# EAGLE design ProtoPass (EAGLE 8.2.1)
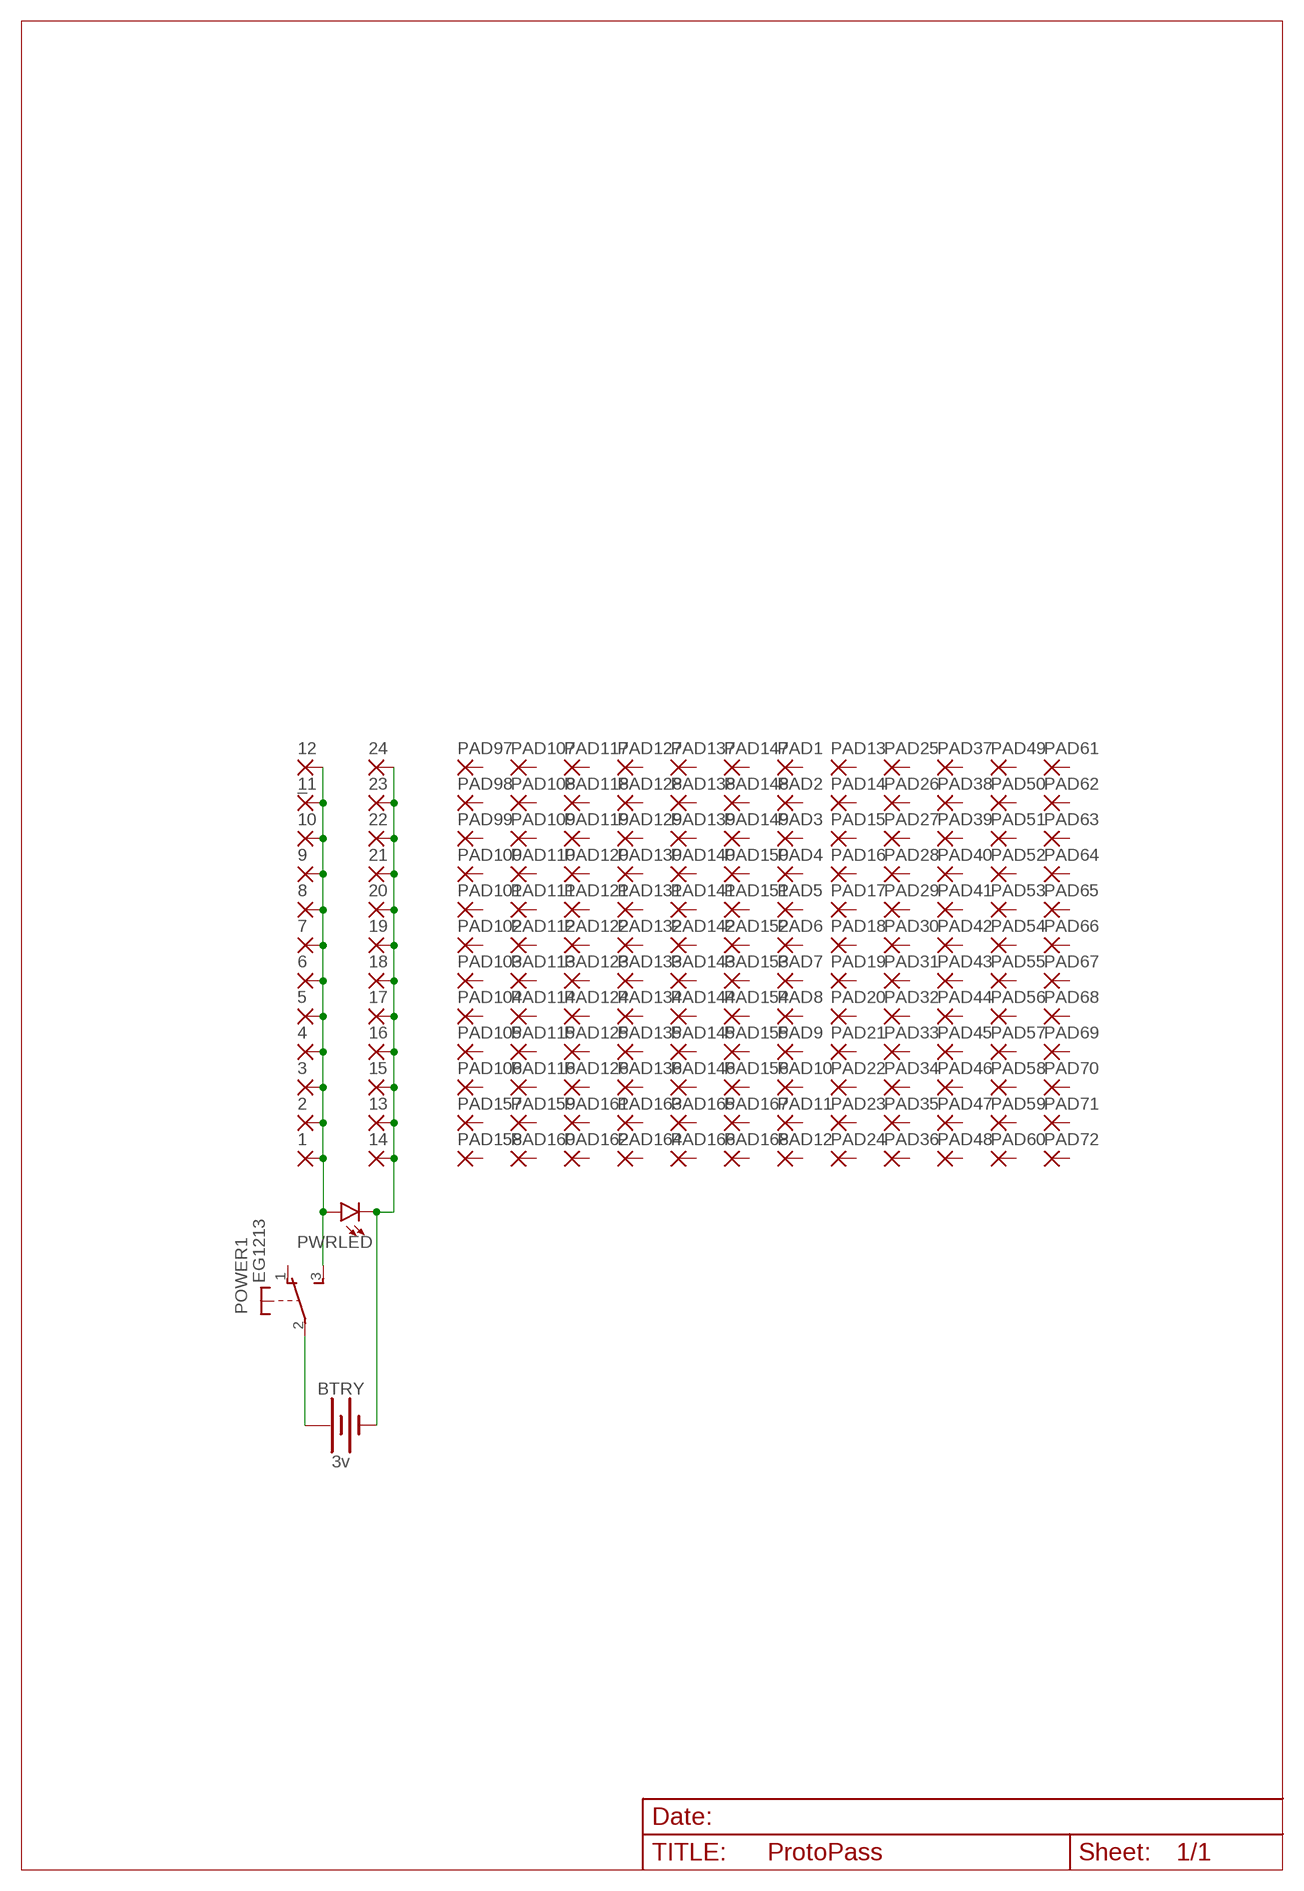
[diagram p0: schematic, sheet 1]

## Parts
1  1,6/0,9  [1,6/0,9]
2  1,6/0,9  [1,6/0,9]
3  1,6/0,9  [1,6/0,9]
4  1,6/0,9  [1,6/0,9]
5  1,6/0,9  [1,6/0,9]
6  1,6/0,9  [1,6/0,9]
7  1,6/0,9  [1,6/0,9]
8  1,6/0,9  [1,6/0,9]
9  1,6/0,9  [1,6/0,9]
10  1,6/0,9  [1,6/0,9]
11  1,6/0,9  [1,6/0,9]
12  _  1,6/0,9  [1,6/0,9]
13  1,6/0,9  [1,6/0,9]
14  1,6/0,9  [1,6/0,9]
15  1,6/0,9  [1,6/0,9]
16  1,6/0,9  [1,6/0,9]
17  1,6/0,9  [1,6/0,9]
18  1,6/0,9  [1,6/0,9]
19  1,6/0,9  [1,6/0,9]
20  1,6/0,9  [1,6/0,9]
21  1,6/0,9  [1,6/0,9]
22  1,6/0,9  [1,6/0,9]
23  1,6/0,9  [1,6/0,9]
24  1,6/0,9  [1,6/0,9]
BTRY  3v  BATTERY-20MM_SMD_4LEGS_OVERPASTE  [BATTCON_20MM_4LEGS_OVERPASTE]
PAD1  1,6/0,9  [1,6/0,9]
PAD2  1,6/0,9  [1,6/0,9]
PAD3  1,6/0,9  [1,6/0,9]
PAD4  1,6/0,9  [1,6/0,9]
PAD5  1,6/0,9  [1,6/0,9]
PAD6  1,6/0,9  [1,6/0,9]
PAD7  1,6/0,9  [1,6/0,9]
PAD8  1,6/0,9  [1,6/0,9]
PAD9  1,6/0,9  [1,6/0,9]
PAD10  1,6/0,9  [1,6/0,9]
PAD11  1,6/0,9  [1,6/0,9]
PAD12  1,6/0,9  [1,6/0,9]
PAD13  1,6/0,9  [1,6/0,9]
PAD14  1,6/0,9  [1,6/0,9]
PAD15  1,6/0,9  [1,6/0,9]
PAD16  1,6/0,9  [1,6/0,9]
PAD17  1,6/0,9  [1,6/0,9]
PAD18  1,6/0,9  [1,6/0,9]
PAD19  1,6/0,9  [1,6/0,9]
PAD20  1,6/0,9  [1,6/0,9]
PAD21  1,6/0,9  [1,6/0,9]
PAD22  1,6/0,9  [1,6/0,9]
PAD23  1,6/0,9  [1,6/0,9]
PAD24  1,6/0,9  [1,6/0,9]
PAD25  1,6/0,9  [1,6/0,9]
PAD26  1,6/0,9  [1,6/0,9]
PAD27  1,6/0,9  [1,6/0,9]
PAD28  1,6/0,9  [1,6/0,9]
PAD29  1,6/0,9  [1,6/0,9]
PAD30  1,6/0,9  [1,6/0,9]
PAD31  1,6/0,9  [1,6/0,9]
PAD32  1,6/0,9  [1,6/0,9]
PAD33  1,6/0,9  [1,6/0,9]
PAD34  1,6/0,9  [1,6/0,9]
PAD35  1,6/0,9  [1,6/0,9]
PAD36  1,6/0,9  [1,6/0,9]
PAD37  1,6/0,9  [1,6/0,9]
PAD38  1,6/0,9  [1,6/0,9]
PAD39  1,6/0,9  [1,6/0,9]
PAD40  1,6/0,9  [1,6/0,9]
PAD41  1,6/0,9  [1,6/0,9]
PAD42  1,6/0,9  [1,6/0,9]
PAD43  1,6/0,9  [1,6/0,9]
PAD44  1,6/0,9  [1,6/0,9]
PAD45  1,6/0,9  [1,6/0,9]
PAD46  1,6/0,9  [1,6/0,9]
PAD47  1,6/0,9  [1,6/0,9]
PAD48  1,6/0,9  [1,6/0,9]
PAD49  1,6/0,9  [1,6/0,9]
PAD50  1,6/0,9  [1,6/0,9]
PAD51  1,6/0,9  [1,6/0,9]
PAD52  1,6/0,9  [1,6/0,9]
PAD53  1,6/0,9  [1,6/0,9]
PAD54  1,6/0,9  [1,6/0,9]
PAD55  1,6/0,9  [1,6/0,9]
PAD56  1,6/0,9  [1,6/0,9]
PAD57  1,6/0,9  [1,6/0,9]
PAD58  1,6/0,9  [1,6/0,9]
PAD59  1,6/0,9  [1,6/0,9]
PAD60  1,6/0,9  [1,6/0,9]
PAD61  1,6/0,9  [1,6/0,9]
PAD62  1,6/0,9  [1,6/0,9]
PAD63  1,6/0,9  [1,6/0,9]
PAD64  1,6/0,9  [1,6/0,9]
PAD65  1,6/0,9  [1,6/0,9]
PAD66  1,6/0,9  [1,6/0,9]
PAD67  1,6/0,9  [1,6/0,9]
PAD68  1,6/0,9  [1,6/0,9]
PAD69  1,6/0,9  [1,6/0,9]
PAD70  1,6/0,9  [1,6/0,9]
PAD71  1,6/0,9  [1,6/0,9]
PAD72  1,6/0,9  [1,6/0,9]
PAD97  1,6/0,9  [1,6/0,9]
PAD98  1,6/0,9  [1,6/0,9]
PAD99  1,6/0,9  [1,6/0,9]
PAD100  1,6/0,9  [1,6/0,9]
PAD101  1,6/0,9  [1,6/0,9]
PAD102  1,6/0,9  [1,6/0,9]
PAD103  1,6/0,9  [1,6/0,9]
PAD104  1,6/0,9  [1,6/0,9]
PAD105  1,6/0,9  [1,6/0,9]
PAD106  1,6/0,9  [1,6/0,9]
PAD107  1,6/0,9  [1,6/0,9]
PAD108  1,6/0,9  [1,6/0,9]
PAD109  1,6/0,9  [1,6/0,9]
PAD110  1,6/0,9  [1,6/0,9]
PAD111  1,6/0,9  [1,6/0,9]
PAD112  1,6/0,9  [1,6/0,9]
PAD113  1,6/0,9  [1,6/0,9]
PAD114  1,6/0,9  [1,6/0,9]
PAD115  1,6/0,9  [1,6/0,9]
PAD116  1,6/0,9  [1,6/0,9]
PAD117  1,6/0,9  [1,6/0,9]
PAD118  1,6/0,9  [1,6/0,9]
PAD119  1,6/0,9  [1,6/0,9]
PAD120  1,6/0,9  [1,6/0,9]
PAD121  1,6/0,9  [1,6/0,9]
PAD122  1,6/0,9  [1,6/0,9]
PAD123  1,6/0,9  [1,6/0,9]
PAD124  1,6/0,9  [1,6/0,9]
PAD125  1,6/0,9  [1,6/0,9]
PAD126  1,6/0,9  [1,6/0,9]
PAD127  1,6/0,9  [1,6/0,9]
PAD128  1,6/0,9  [1,6/0,9]
PAD129  1,6/0,9  [1,6/0,9]
PAD130  1,6/0,9  [1,6/0,9]
PAD131  1,6/0,9  [1,6/0,9]
PAD132  1,6/0,9  [1,6/0,9]
PAD133  1,6/0,9  [1,6/0,9]
PAD134  1,6/0,9  [1,6/0,9]
PAD135  1,6/0,9  [1,6/0,9]
PAD136  1,6/0,9  [1,6/0,9]
PAD137  1,6/0,9  [1,6/0,9]
PAD138  1,6/0,9  [1,6/0,9]
PAD139  1,6/0,9  [1,6/0,9]
PAD140  1,6/0,9  [1,6/0,9]
PAD141  1,6/0,9  [1,6/0,9]
PAD142  1,6/0,9  [1,6/0,9]
PAD143  1,6/0,9  [1,6/0,9]
PAD144  1,6/0,9  [1,6/0,9]
PAD145  1,6/0,9  [1,6/0,9]
PAD146  1,6/0,9  [1,6/0,9]
PAD147  1,6/0,9  [1,6/0,9]
PAD148  1,6/0,9  [1,6/0,9]
PAD149  1,6/0,9  [1,6/0,9]
PAD150  1,6/0,9  [1,6/0,9]
PAD151  1,6/0,9  [1,6/0,9]
PAD152  1,6/0,9  [1,6/0,9]
PAD153  1,6/0,9  [1,6/0,9]
PAD154  1,6/0,9  [1,6/0,9]
PAD155  1,6/0,9  [1,6/0,9]
PAD156  1,6/0,9  [1,6/0,9]
PAD157  1,6/0,9  [1,6/0,9]
PAD158  1,6/0,9  [1,6/0,9]
PAD159  1,6/0,9  [1,6/0,9]
PAD160  1,6/0,9  [1,6/0,9]
PAD161  1,6/0,9  [1,6/0,9]
PAD162  1,6/0,9  [1,6/0,9]
PAD163  1,6/0,9  [1,6/0,9]
PAD164  1,6/0,9  [1,6/0,9]
PAD165  1,6/0,9  [1,6/0,9]
PAD166  1,6/0,9  [1,6/0,9]
PAD167  1,6/0,9  [1,6/0,9]
PAD168  1,6/0,9  [1,6/0,9]
POWER  EG1213  [EG1213]
PWRLED  LED5MM  [LED_5MM]

## Nets
N$1: 13.1(P) 14.1(P) 15.1(P) 16.1(P) 17.1(P) 18.1(P) 19.1(P) 20.1(P) 21.1(P) 22.1(P) 23.1(P) 24.1(P) BTRY.2(-) PWRLED.K(C)
N$2: BTRY.1(+) POWER.2(1:P)
N$4: 1.1(P) 2.1(P) 3.1(P) 4.1(P) 5.1(P) 6.1(P) 7.1(P) 8.1(P) 9.1(P) 10.1(P) 11.1(P) 12.1(P) POWER.3(1:S) PWRLED.A
Unconnected: PAD1.1(P) PAD2.1(P) PAD3.1(P) PAD4.1(P) PAD5.1(P) PAD6.1(P) PAD7.1(P) PAD8.1(P) PAD9.1(P) PAD10.1(P) PAD11.1(P) PAD12.1(P) PAD13.1(P) PAD14.1(P) PAD15.1(P) PAD16.1(P) PAD17.1(P) PAD18.1(P) PAD19.1(P) PAD20.1(P) PAD21.1(P) PAD22.1(P) PAD23.1(P) PAD24.1(P) PAD25.1(P) PAD26.1(P) PAD27.1(P) PAD28.1(P) PAD29.1(P) PAD30.1(P) PAD31.1(P) PAD32.1(P) PAD33.1(P) PAD34.1(P) PAD35.1(P) PAD36.1(P) PAD37.1(P) PAD38.1(P) PAD39.1(P) PAD40.1(P) PAD41.1(P) PAD42.1(P) PAD43.1(P) PAD44.1(P) PAD45.1(P) PAD46.1(P) PAD47.1(P) PAD48.1(P) PAD49.1(P) PAD50.1(P) PAD51.1(P) PAD52.1(P) PAD53.1(P) PAD54.1(P) PAD55.1(P) PAD56.1(P) PAD57.1(P) PAD58.1(P) PAD59.1(P) PAD60.1(P) PAD61.1(P) PAD62.1(P) PAD63.1(P) PAD64.1(P) PAD65.1(P) PAD66.1(P) PAD67.1(P) PAD68.1(P) PAD69.1(P) PAD70.1(P) PAD71.1(P) PAD72.1(P) PAD97.1(P) PAD98.1(P) PAD99.1(P) PAD100.1(P) PAD101.1(P) PAD102.1(P) PAD103.1(P) PAD104.1(P) PAD105.1(P) PAD106.1(P) PAD107.1(P) PAD108.1(P) PAD109.1(P) PAD110.1(P) PAD111.1(P) PAD112.1(P) PAD113.1(P) PAD114.1(P) PAD115.1(P) PAD116.1(P) PAD117.1(P) PAD118.1(P) PAD119.1(P) PAD120.1(P) PAD121.1(P) PAD122.1(P) PAD123.1(P) PAD124.1(P) PAD125.1(P) PAD126.1(P) PAD127.1(P) PAD128.1(P) PAD129.1(P) PAD130.1(P) PAD131.1(P) PAD132.1(P) PAD133.1(P) PAD134.1(P) PAD135.1(P) PAD136.1(P) PAD137.1(P) PAD138.1(P) PAD139.1(P) PAD140.1(P) PAD141.1(P) PAD142.1(P) PAD143.1(P) PAD144.1(P) PAD145.1(P) PAD146.1(P) PAD147.1(P) PAD148.1(P) PAD149.1(P) PAD150.1(P) PAD151.1(P) PAD152.1(P) PAD153.1(P) PAD154.1(P) PAD155.1(P) PAD156.1(P) PAD157.1(P) PAD158.1(P) PAD159.1(P) PAD160.1(P) PAD161.1(P) PAD162.1(P) PAD163.1(P) PAD164.1(P) PAD165.1(P) PAD166.1(P) PAD167.1(P) PAD168.1(P) POWER.1(1:O) POWER.MT1(MT) POWER.MT2(MT)

## Library data of the parts
1-24 PAD1-PAD72 PAD97-PAD168 = wirepad:1,6/0,9: THROUGH-HOLE PAD
BTRY = SparkFun-Batteries:BATTERY: Battery - Single Cell A variety of battery chemistries, sizes, and footprints. Device List: 20MM_PTH - Coin Cell Battery Holder - 20mm (PTH) <https://www.sparkfun.com/products/783> 12MM_SMD - Coin Cell Battery Holder - 12mm (SMD) <https://www.sparkfun.com/products/10592> 12MM_PTH - Coin Cell Battery Holder - 12mm (PTH) <https://www.sparkfun.com/products/7948> 20MM_SMD - 20mm Coin Cell Battery Holder (SMD) (2 legs) Used on the Big Time Watch Kit <https://www.sparkfun.com/products/11734> 20MM_SMD_4LEGS - Coin Cell Battery Holder - 20mm (SMD) <https://www.sparkfun.com/products/11892> 20MM_SMD_4LEGS_OVERPASTE - Coin Cell Battery Holder - 20mm (SMD) <https://www.sparkfun.com/products/11892> (Over-paste on the legs) 24.5MM_PTH - Coin Cell Battery Holder - 24.5mm (PTH) <https://www.sparkfun.com/products/8863> 9V - 9V Battery Holder - PC Mount Used on the SparkFun SparkPunk Sound Kit <https://www.sparkfun.com/products/11177> and SparkFun SparkPunk Sequencer Kit <https://www.sparkfun.com/products/12707> 18650 - Battery Holder - 18650 (PTH) <https://www.sparkfun.com/products/13113> AA - Battery Holder - 1xAA (PTH) <https://www.sparkfun.com/products/7949> AAA - Battery Holder - 1xAAA (PTH) <https://www.sparkfun.com/products/12718> AA_KIT - Battery Holder - 1xAA (PTH) <https://www.sparkfun.com/products/7949> Special kit package - pads only have exposed copper on one side of the board. AAA_KIT - Battery Holder - 1xAAA (PTH) <https://www.sparkfun.com/products/12718> Special kit package - pads only have exposed copper on one side of the board.; PROD_ID: PRT-11892; SF_SKU: BATT-10373
POWER = adafruit:EG1213: E-Switch right-angle slide SPDT Part #EG1213 http://www.ladyada.net/library/eagle
PWRLED = SparkFun-LED:LED: LED (Generic) Standard schematic elements and footprints for 5mm, 3mm, 1206, and 0603 sized LEDs. Generic LEDs with no color specified.

## Board
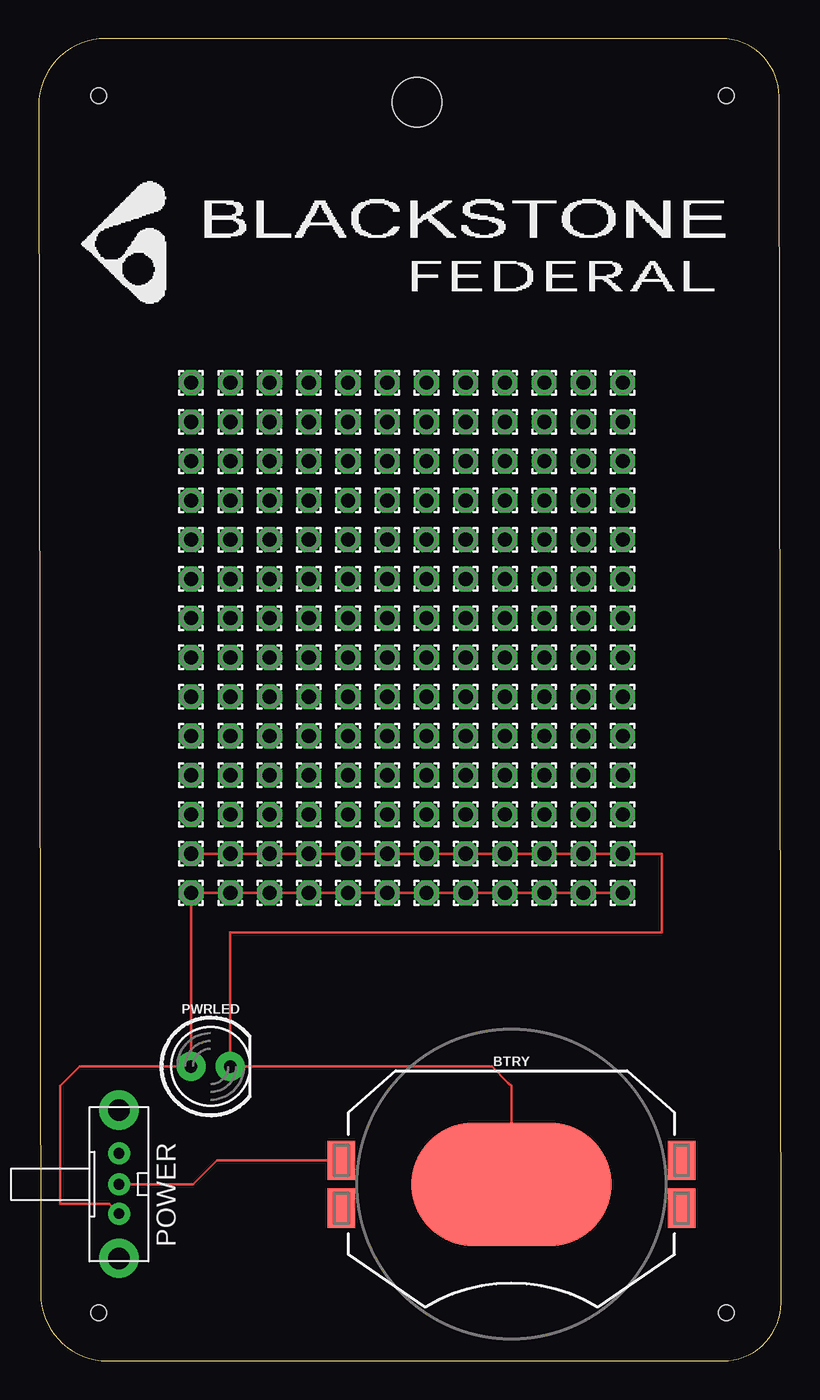
[diagram p1: board, top side]
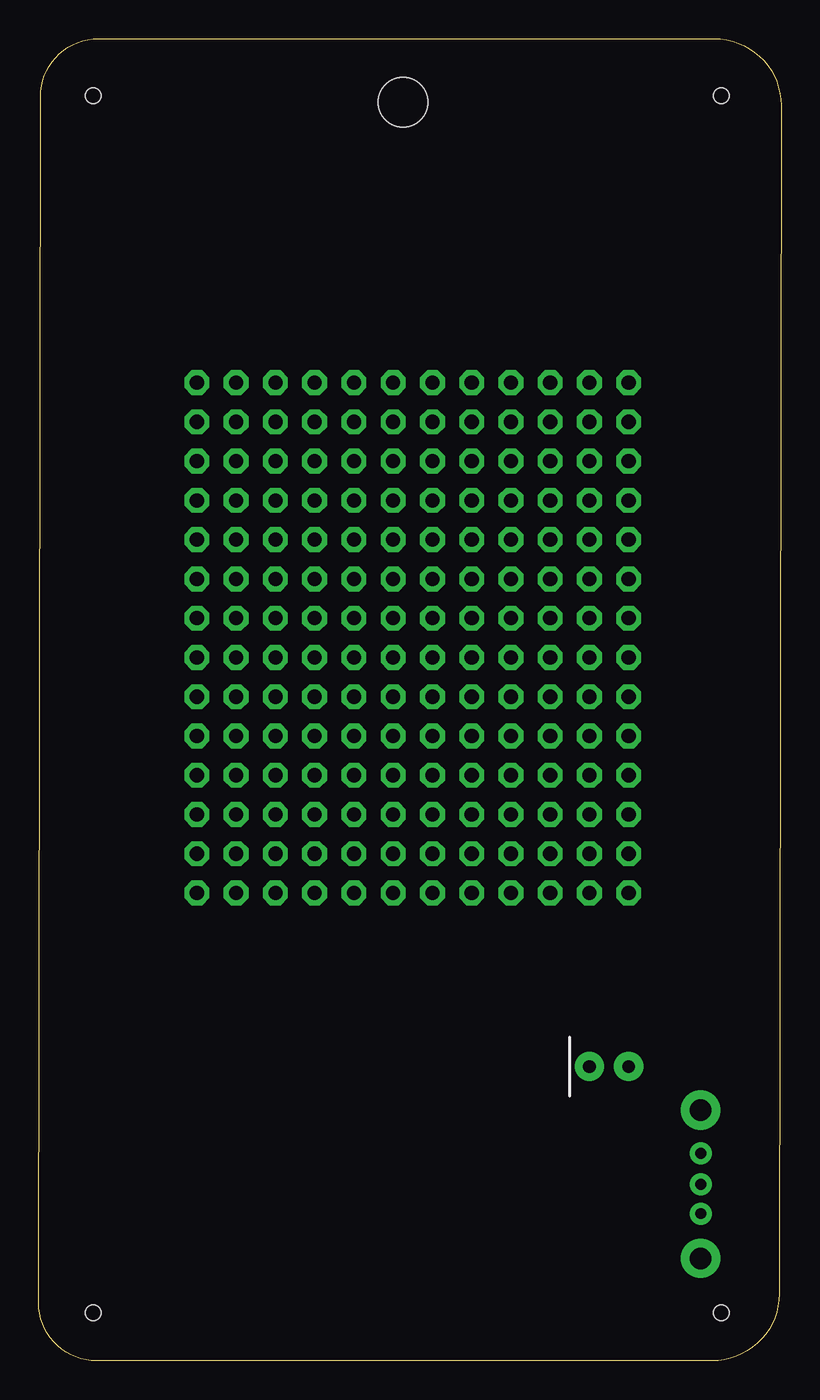
[diagram p2: board, bottom side, seen from below]

Size 48.05 x 85.56 mm. Coordinates in mm from the lower left corner, seen from the top.
Outline: 44.19,85.56 4.32,85.56 arc90 0,81.24 0.12,4.34 arc90 4.46,0 44.3,0 arc90 48.05,3.75 47.93,81.82 arc90 44.19,85.56
Copper layers (1*16): Top 0.035mm / dielectric 1.5mm / Bottom 0.035mm
Design rules "default": minimum track width 6mil, minimum drill 0.35mm, track to track 6mil, track to pad 6mil, pad to pad 6mil, via to via 6mil, smd to smd 6mil, copper to edge 40mil, drill to drill 6mil, minimum pad ring 10mil, minimum via ring 8mil, stop-mask expansion 4mil, vias tented up to drill 0mil, thermal gap 10mil
Holes 3.2 mm at 24.48,81.43
Holes 1 mm at 44.51,3.1 3.87,3.1 44.52,81.86 3.88,81.86

### Footprints (pad centres in the part's own frame; a part is rotated, then mirrored left to right if it is on the bottom)
1,6/0,9 = drill 0.914 pad 1.6 octagon: 1 0,0
BATTCON_20MM_4LEGS_OVERPASTE = smd 1.778 x 2.54: 1 -11,1.55; 3 11,1.55; P$1 -11,-1.55; P$2 11,-1.55 | smd 13 x 8: 2 0,0
EG1213 = drill 0.7 pad 1.422: 1 -2,0; 2 0,0; 3 1.9,0 | drill 1.4 pad 2.54: MT1 -4.8,0; MT2 4.8,0
LED_5MM = drill 0.813 pad 1.88: A -1.27,0; K 1.27,0

### Placement (x,y rotation side)
1  9.87,30.28 270 top
2  12.41,30.28 270 top
3  14.95,30.28 270 top
4  17.49,30.28 270 top
5  20.03,30.28 270 top
6  22.57,30.28 270 top
7  25.11,30.28 270 top
8  27.65,30.28 270 top
9  30.19,30.28 270 top
10  32.73,30.28 270 top
11  35.27,30.28 270 top
12  37.81,30.28 270 top
13  9.87,32.82 270 top
14  12.41,32.82 270 top
15  14.95,32.82 270 top
16  17.49,32.82 270 top
17  20.03,32.82 270 top
18  22.57,32.82 270 top
19  25.11,32.82 270 top
20  27.65,32.82 270 top
21  30.19,32.82 270 top
22  32.73,32.82 270 top
23  35.27,32.82 270 top
24  37.81,32.82 270 top
BTRY  30.6,11.43 0 top
PAD1  37.81,35.36 0 top
PAD2  37.81,37.9 0 top
PAD3  37.81,40.44 0 top
PAD4  37.81,42.98 0 top
PAD5  37.81,45.52 0 top
PAD6  37.81,48.06 0 top
PAD7  37.81,50.6 0 top
PAD8  37.81,53.14 0 top
PAD9  37.81,55.68 0 top
PAD10  37.81,58.22 0 top
PAD11  37.81,60.76 0 top
PAD12  37.81,63.3 0 top
PAD13  35.27,35.36 0 top
PAD14  35.27,37.9 0 top
PAD15  35.27,40.44 0 top
PAD16  35.27,42.98 0 top
PAD17  35.27,45.52 0 top
PAD18  35.27,48.06 0 top
PAD19  35.27,50.6 0 top
PAD20  35.27,53.14 0 top
PAD21  35.27,55.68 0 top
PAD22  35.27,58.22 0 top
PAD23  35.27,60.76 0 top
PAD24  35.27,63.3 0 top
PAD25  32.73,35.36 0 top
PAD26  32.73,37.9 0 top
PAD27  32.73,40.44 0 top
PAD28  32.73,42.98 0 top
PAD29  32.73,45.52 0 top
PAD30  32.73,48.06 0 top
PAD31  32.73,50.6 0 top
PAD32  32.73,53.14 0 top
PAD33  32.73,55.68 0 top
PAD34  32.73,58.22 0 top
PAD35  32.73,60.76 0 top
PAD36  32.73,63.3 0 top
PAD37  30.19,35.36 0 top
PAD38  30.19,37.9 0 top
PAD39  30.19,40.44 0 top
PAD40  30.19,42.98 0 top
PAD41  30.19,45.52 0 top
PAD42  30.19,48.06 0 top
PAD43  30.19,50.6 0 top
PAD44  30.19,53.14 0 top
PAD45  30.19,55.68 0 top
PAD46  30.19,58.22 0 top
PAD47  30.19,60.76 0 top
PAD48  30.19,63.3 0 top
PAD49  27.65,35.36 0 top
PAD50  27.65,37.9 0 top
PAD51  27.65,40.44 0 top
PAD52  27.65,42.98 0 top
PAD53  27.65,45.52 0 top
PAD54  27.65,48.06 0 top
PAD55  27.65,50.6 0 top
PAD56  27.65,53.14 0 top
PAD57  27.65,55.68 0 top
PAD58  27.65,58.22 0 top
PAD59  27.65,60.76 0 top
PAD60  27.65,63.3 0 top
PAD61  25.11,35.36 0 top
PAD62  25.11,37.9 0 top
PAD63  25.11,40.44 0 top
PAD64  25.11,42.98 0 top
PAD65  25.11,45.52 0 top
PAD66  25.11,48.06 0 top
PAD67  25.11,50.6 0 top
PAD68  25.11,53.14 0 top
PAD69  25.11,55.68 0 top
PAD70  25.11,58.22 0 top
PAD71  25.11,60.76 0 top
PAD72  25.11,63.3 0 top
PAD97  22.57,35.36 0 top
PAD98  22.57,37.9 0 top
PAD99  22.57,40.44 0 top
PAD100  22.57,42.98 0 top
PAD101  22.57,45.52 0 top
PAD102  22.57,48.06 0 top
PAD103  22.57,50.6 0 top
PAD104  22.57,53.14 0 top
PAD105  22.57,55.68 0 top
PAD106  22.57,58.22 0 top
PAD107  22.57,60.76 0 top
PAD108  22.57,63.3 0 top
PAD109  20.03,35.36 0 top
PAD110  20.03,37.9 0 top
PAD111  20.03,40.44 0 top
PAD112  20.03,42.98 0 top
PAD113  20.03,45.52 0 top
PAD114  20.03,48.06 0 top
PAD115  20.03,50.6 0 top
PAD116  20.03,53.14 0 top
PAD117  20.03,55.68 0 top
PAD118  20.03,58.22 0 top
PAD119  20.03,60.76 0 top
PAD120  20.03,63.3 0 top
PAD121  17.49,35.36 0 top
PAD122  17.49,37.9 0 top
PAD123  17.49,40.44 0 top
PAD124  17.49,42.98 0 top
PAD125  17.49,45.52 0 top
PAD126  17.49,48.06 0 top
PAD127  17.49,50.6 0 top
PAD128  17.49,53.14 0 top
PAD129  17.49,55.68 0 top
PAD130  17.49,58.22 0 top
PAD131  17.49,60.76 0 top
PAD132  17.49,63.3 0 top
PAD133  14.95,35.36 0 top
PAD134  14.95,37.9 0 top
PAD135  14.95,40.44 0 top
PAD136  14.95,42.98 0 top
PAD137  14.95,45.52 0 top
PAD138  14.95,48.06 0 top
PAD139  14.95,50.6 0 top
PAD140  14.95,53.14 0 top
PAD141  14.95,55.68 0 top
PAD142  14.95,58.22 0 top
PAD143  14.95,60.76 0 top
PAD144  14.95,63.3 0 top
PAD145  12.41,35.36 0 top
PAD146  12.41,37.9 0 top
PAD147  12.41,40.44 0 top
PAD148  12.41,42.98 0 top
PAD149  12.41,45.52 0 top
PAD150  12.41,48.06 0 top
PAD151  12.41,50.6 0 top
PAD152  12.41,53.14 0 top
PAD153  12.41,55.68 0 top
PAD154  12.41,58.22 0 top
PAD155  12.41,60.76 0 top
PAD156  12.41,63.3 0 top
PAD157  9.87,35.36 0 top
PAD158  9.87,37.9 0 top
PAD159  9.87,40.44 0 top
PAD160  9.87,42.98 0 top
PAD161  9.87,45.52 0 top
PAD162  9.87,48.06 0 top
PAD163  9.87,50.6 0 top
PAD164  9.87,53.14 0 top
PAD165  9.87,55.68 0 top
PAD166  9.87,58.22 0 top
PAD167  9.87,63.3 0 top
PAD168  9.87,60.76 0 top
POWER  5.2,11.43 270 top
PWRLED  11.14,19.05 0 top

### Tracks (layer width: path | path; a pad name or v marks a point on that pad's centre or on a via)
N$1
  Top 0.152: 13.1 14.1 15.1 16.1 17.1 18.1 19.1 20.1 21.1 22.1 23.1 24.1 40.34,32.82 40.34,27.74 12.4,27.74 PWRLED.K 29.33,19.05 30.38,18 | 30.38,18 30.6,17.78 | BTRY.2 30.6,17.78 | 30.6,17.78 30.38,18
N$2
  Top 0.152: POWER.2 9.99,11.43 11.54,12.98 BTRY.1
N$4
  Top 0.152: 12.1 11.1 10.1 9.1 8.1 7.1 6.1 5.1 4.1 3.1 2.1 1.1 PWRLED.A 2.66,19.05 1.39,17.78 1.39,10.16 4.57,10.16 POWER.3